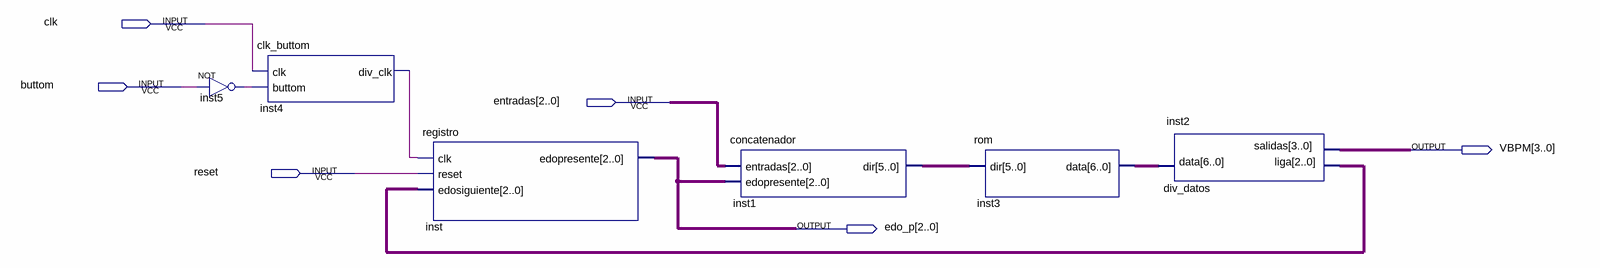
[diagram p0: schematic sheet]
// Quartus schematic practica3.bdf as structural Verilog: 6 symbols, 6 pins
module practica3 (
  input  clk,
  input  buttom,
  input  [2:0] entradas,
  input  reset,
  output [3:0] VBPM,
  output [2:0] edo_p
);

  wire inst4_div_clk, inst5_out;
  wire [2:0] inst2_liga;
  wire [5:0] inst1_dir;
  wire [6:0] inst3_data;

  not inst5 (inst5_out, buttom);
  clk_buttom inst4 (.clk(clk), .buttom(inst5_out), .div_clk(inst4_div_clk));
  registro inst (.clk(inst4_div_clk), .reset(reset), .edosiguiente(inst2_liga), .edopresente(edo_p));
  concatenador inst1 (.entradas(entradas), .edopresente(edo_p), .dir(inst1_dir));
  rom inst3 (.dir(inst1_dir), .data(inst3_data));
  div_datos inst2 (.data(inst3_data), .liga(inst2_liga), .salidas(VBPM));
endmodule
